# EAGLE schematic A13-OLinuXino (EAGLE 4.16)
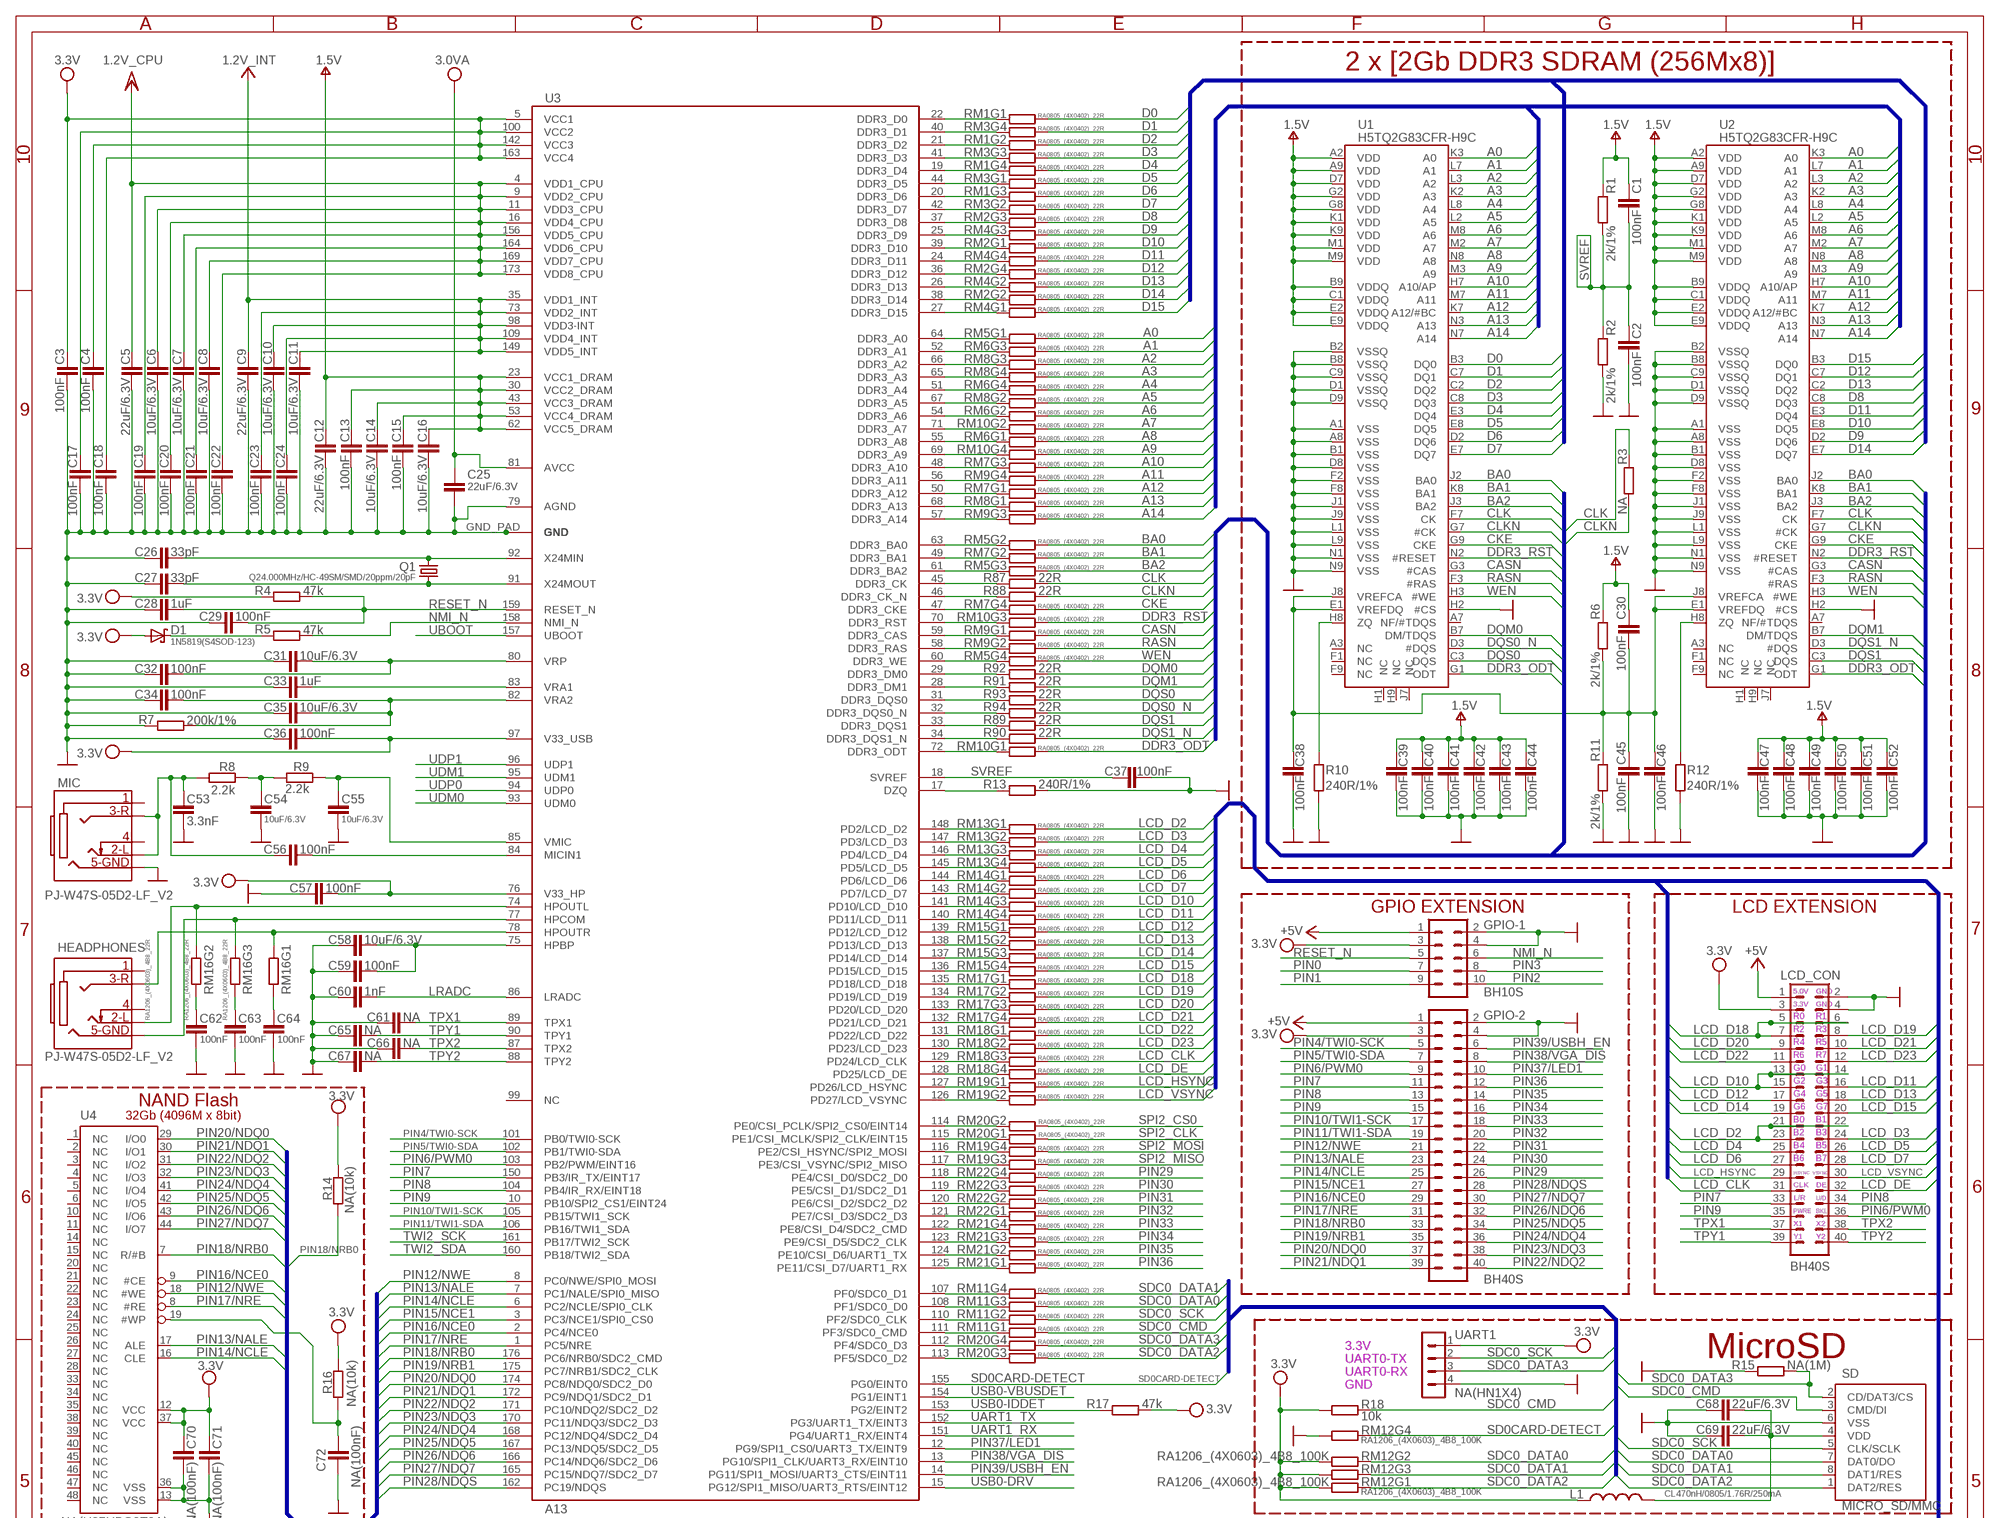
[diagram p0: schematic, sheet 1, part 1 of 2]
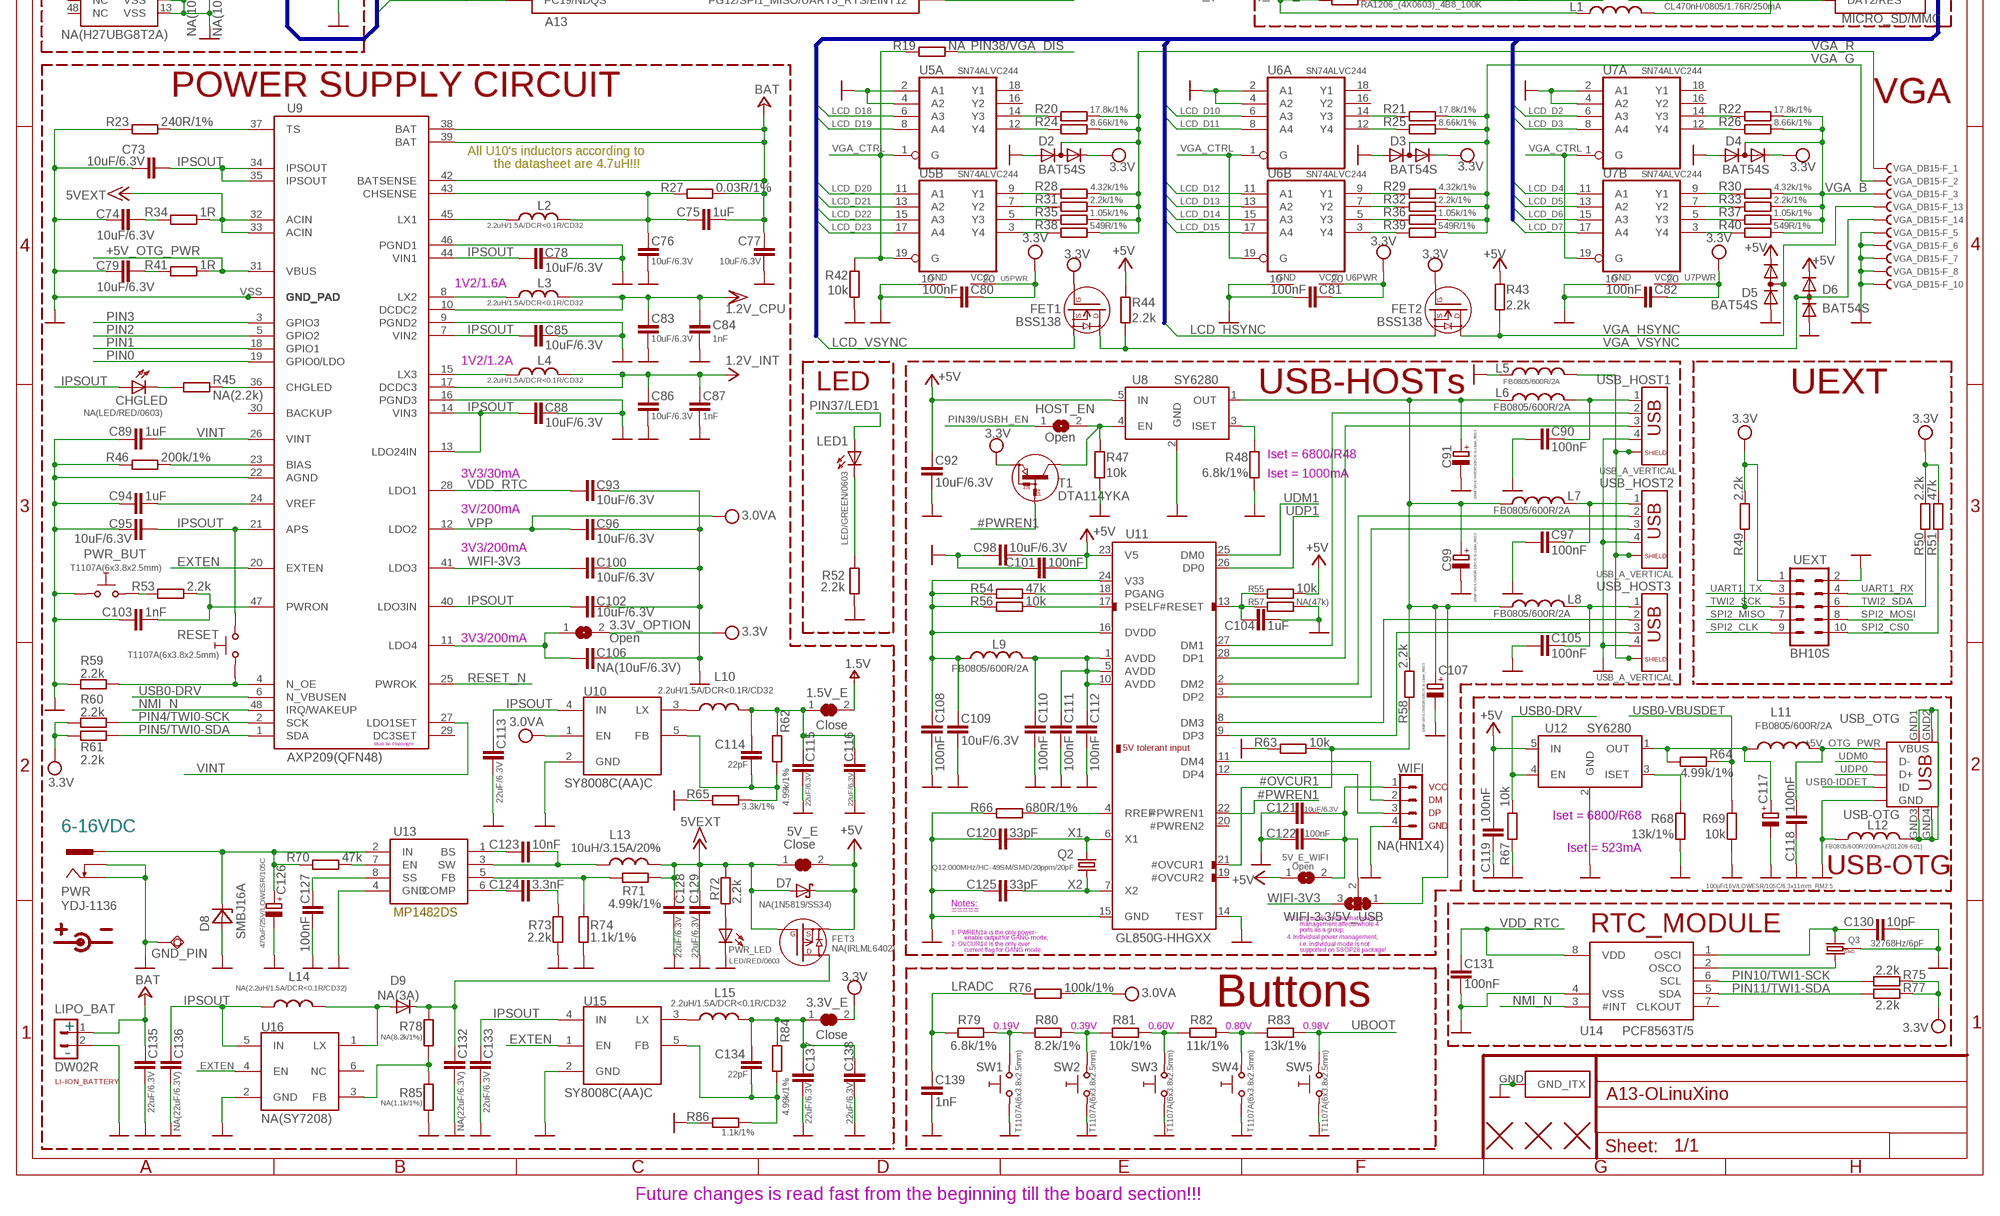
[diagram p1: schematic, sheet 1, part 2 of 2]

## Parts
1.5V_E  Close  SJSJ_1_SMALLER_CLOSE  [SJ_1_SMALLER_CLOSE]
3.3V_E  Close  SJSJ_1_SMALLER_CLOSE  [SJ_1_SMALLER_CLOSE]
3.3V_OPTION  Open  SJSJ_SMALLER  [SJ_1_SMALLER]
5V_E  Close  SJSJ_1_SMALLER_CLOSE  [SJ_1_SMALLER_CLOSE]
5V_E_WIFI  Open  SJSJ_SMALLER  [SJ_1_SMALLER]
C1  100nF  C-EUC0603_DWS  [C0603_DWS]
C2  100nF  C-EUC0603_DWS  [C0603_DWS]
C3  100nF  C-EUC0603_DWS  [C0603_DWS]
C4  100nF  C-EUC0603_DWS  [C0603_DWS]
C5  22uF/6.3V  C-EUC0603_DWS  [C0603_DWS]
C6  10uF/6.3V  C-EUC0603_DWS  [C0603_DWS]
C7  10uF/6.3V  C-EUC0603_DWS  [C0603_DWS]
C8  10uF/6.3V  C-EUC0603_DWS  [C0603_DWS]
C9  22uF/6.3V  C-EUC0603_DWS  [C0603_DWS]
C10  10uF/6.3V  C-EUC0603_DWS  [C0603_DWS]
C11  10uF/6.3V  C-EUC0603_DWS  [C0603_DWS]
C12  22uF/6.3V  C-EUC0603_DWS  [C0603_DWS]
C13  100nF  C-EUC0603_DWS  [C0603_DWS]
C14  10uF/6.3V  C-EUC0603_DWS  [C0603_DWS]
C15  100nF  C-EUC0603_DWS  [C0603_DWS]
C16  10uF/6.3V  C-EUC0603_DWS  [C0603_DWS]
C17  100nF  C-EUC0603_DWS  [C0603_DWS]
C18  100nF  C-EUC0603_DWS  [C0603_DWS]
C19  100nF  C-EUC0603_DWS  [C0603_DWS]
C20  100nF  C-EUC0603_DWS  [C0603_DWS]
C21  100nF  C-EUC0603_DWS  [C0603_DWS]
C22  100nF  C-EUC0603_DWS  [C0603_DWS]
C23  100nF  C-EUC0603_DWS  [C0603_DWS]
C24  100nF  C-EUC0603_DWS  [C0603_DWS]
C25  22uF/6.3V  C-EUC0603_DWS  [C0603_DWS]
C26  33pF  C-EUC0603_DWS  [C0603_DWS]
C27  33pF  C-EUC0603_DWS  [C0603_DWS]
C28  1uF  C-EUC0603_DWS  [C0603_DWS]
C29  100nF  C-EUC0603_DWS  [C0603_DWS]
C30  100nF  C-EUC0603_DWS  [C0603_DWS]
C31  10uF/6.3V  C-EUC0603_DWS  [C0603_DWS]
C32  100nF  C-EUC0603_DWS  [C0603_DWS]
C33  1uF  C-EUC0603_DWS  [C0603_DWS]
C34  100nF  C-EUC0603_DWS  [C0603_DWS]
C35  10uF/6.3V  C-EUC0603_DWS  [C0603_DWS]
C36  100nF  C-EUC0603_DWS  [C0603_DWS]
C37  100nF  C-EUC0603_DWS  [C0603_DWS]
C38  100nF  C-EUC0603_DWS  [C0603_DWS]
C39  100nF  C-EUC0603_DWS  [C0603_DWS]
C40  100nF  C-EUC0603_DWS  [C0603_DWS]
C41  100nF  C-EUC0603_DWS  [C0603_DWS]
C42  100nF  C-EUC0603_DWS  [C0603_DWS]
C43  100nF  C-EUC0603_DWS  [C0603_DWS]
C44  100nF  C-EUC0603_DWS  [C0603_DWS]
C45  100nF  C-EUC0603_DWS  [C0603_DWS]
C46  100nF  C-EUC0603_DWS  [C0603_DWS]
C47  100nF  C-EUC0603_DWS  [C0603_DWS]
C48  100nF  C-EUC0603_DWS  [C0603_DWS]
C49  100nF  C-EUC0603_DWS  [C0603_DWS]
C50  100nF  C-EUC0603_DWS  [C0603_DWS]
C51  100nF  C-EUC0603_DWS  [C0603_DWS]
C52  100nF  C-EUC0603_DWS  [C0603_DWS]
C53  3.3nF  C-EUC0603_DWS  [C0603_DWS]
C54  10uF/6.3V  C-EUC0603_DWS  [C0603_DWS]
C55  10uF/6.3V  C-EUC0603_DWS  [C0603_DWS]
C56  100nF  C-EUC0603_DWS  [C0603_DWS]
C57  100nF  C-EUC0603_DWS  [C0603_DWS]
C58  10uF/6.3V  C-EUC0603_DWS  [C0603_DWS]
C59  100nF  C-EUC0603_DWS  [C0603_DWS]
C60  1nF  C-EUC0603_DWS  [C0603_DWS]
C61  NA  C-EUC0603_DWS  [C0603_DWS]
C62  100nF  C-EUC0603_DWS  [C0603_DWS]
C63  100nF  C-EUC0603_DWS  [C0603_DWS]
C64  100nF  C-EUC0603_DWS  [C0603_DWS]
C65  NA  C-EUC0603_DWS  [C0603_DWS]
C66  NA  C-EUC0603_DWS  [C0603_DWS]
C67  NA  C-EUC0603_DWS  [C0603_DWS]
C68  22uF/6.3V  C-EUC0603_DWS  [C0603_DWS]
C69  22uF/6.3V  C-EUC0603_DWS  [C0603_DWS]
C70  NA(100nF)  C-EUC0603_DWS  [C0603_DWS]
C71  NA(100nF)  C-EUC0603_DWS  [C0603_DWS]
C72  NA(100nF)  C-EUC0603_DWS  [C0603_DWS]
C73  10uF/6.3V  C-EUC0603_DWS  [C0603_DWS]
C74  10uF/6.3V  C-EUC0603_DWS  [C0603_DWS]
C75  1uF  C-EUC0603_DWS  [C0603_DWS]
C76  10uF/6.3V  C-EUC0603_DWS  [C0603_DWS]
C77  10uF/6.3V  C-EUC0603_DWS  [C0603_DWS]
C78  10uF/6.3V  C-EUC0603_DWS  [C0603_DWS]
C79  10uF/6.3V  C-EUC0603_DWS  [C0603_DWS]
C80  100nF  C-EUC0603_DWS  [C0603_DWS]
C81  100nF  C-EUC0603_DWS  [C0603_DWS]
C82  100nF  C-EUC0603_DWS  [C0603_DWS]
C83  10uF/6.3V  C-EUC0603_DWS  [C0603_DWS]
C84  1nF  C-EUC0603_DWS  [C0603_DWS]
C85  10uF/6.3V  C-EUC0603_DWS  [C0603_DWS]
C86  10uF/6.3V  C-EUC0603_DWS  [C0603_DWS]
C87  1nF  C-EUC0603_DWS  [C0603_DWS]
C88  10uF/6.3V  C-EUC0603_DWS  [C0603_DWS]
C89  1uF  C-EUC0603_DWS  [C0603_DWS]
C90  100nF  C-EUC0603_DWS  [C0603_DWS]
C91  100uF/16V/LOWESR/105C/6.3x11mm_RM2.5  CPOL-EUE2.5-6.3  [E2,5-6,3]
C92  10uF/6.3V  C-EUC0603_DWS  [C0603_DWS]
C93  10uF/6.3V  C-EUC0603_DWS  [C0603_DWS]
C94  1uF  C-EUC0603_DWS  [C0603_DWS]
C95  10uF/6.3V  C-EUC0603_DWS  [C0603_DWS]
C96  10uF/6.3V  C-EUC0603_DWS  [C0603_DWS]
C97  100nF  C-EUC0603_DWS  [C0603_DWS]
C98  10uF/6.3V  C-EUC0603_DWS  [C0603_DWS]
C99  100uF/16V/LOWESR/105C/6.3x11mm_RM2.5  CPOL-EUE2.5-6.3  [E2,5-6,3]
C100  10uF/6.3V  C-EUC0603_DWS  [C0603_DWS]
C101  100nF  C-EUC0603_DWS  [C0603_DWS]
C102  10uF/6.3V  C-EUC0603_DWS  [C0603_DWS]
C103  1nF  C-EUC0603_DWS  [C0603_DWS]
C104  1uF  C-EUC0603_DWS  [C0603_DWS]
C105  100nF  C-EUC0603_DWS  [C0603_DWS]
C106  NA(10uF/6.3V)  C-EUC0603_DWS  [C0603_DWS]
C107  100uF/16V/LOWESR/105C/6.3x11mm_RM2.5  CPOL-EUE2.5-6.3  [E2,5-6,3]
C108  100nF  C-EUC0603_DWS  [C0603_DWS]
C109  10uF/6.3V  C-EUC0603_DWS  [C0603_DWS]
C110  100nF  C-EUC0603_DWS  [C0603_DWS]
C111  100nF  C-EUC0603_DWS  [C0603_DWS]
C112  100nF  C-EUC0603_DWS  [C0603_DWS]
C113  22uF/6.3V  C-EUC0603_DWS  [C0603_DWS]
C114  22pF  C-EUC0603_DWS  [C0603_DWS]
C115  22uF/6.3V  C-EUC0603_DWS  [C0603_DWS]
C116  22uF/6.3V  C-EUC0603_DWS  [C0603_DWS]
C117  100uF/16V/LOWESR/105C/6.3x11mm_RM2.5  CPOL-EUE2.5-6.3  [E2,5-6,3]
C118  100nF  C-EUC0603_DWS  [C0603_DWS]
C119  100nF  C-EUC0603_DWS  [C0603_DWS]
C120  33pF  C-EUC0603_DWS  [C0603_DWS]
C121  10uF/6.3V  C-EUC0603_DWS  [C0603_DWS]
C122  100nF  C-EUC0603_DWS  [C0603_DWS]
C123  10nF  C-EUC0603_DWS  [C0603_DWS]
C124  3.3nF  C-EUC0603_DWS  [C0603_DWS]
C125  33pF  C-EUC0603_DWS  [C0603_DWS]
C126  470uF/25V/LOWESR/105C  CPOL-EUE5-10.5  [E5-10,5]
C127  100nF  C-EUC0603_DWS  [C0603_DWS]
C128  22uF/6.3V  C-EUC0603_DWS  [C0603_DWS]
C129  22uF/6.3V  C-EUC0603_DWS  [C0603_DWS]
C130  10pF  C-EUC0603_DWS  [C0603_DWS]
C131  100nF  C-EUC0603_DWS  [C0603_DWS]
C132  NA(22uF/6.3V)  C-EUC0603_DWS  [C0603_DWS]
C133  22uF/6.3V  C-EUC0603_DWS  [C0603_DWS]
C134  22pF  C-EUC0603_DWS  [C0603_DWS]
C135  22uF/6.3V  C-EUC0603_DWS  [C0603_DWS]
C136  NA(22uF/6.3V)  C-EUC0603_DWS  [C0603_DWS]
C137  22uF/6.3V  C-EUC0603_DWS  [C0603_DWS]
C138  22uF/6.3V  C-EUC0603_DWS  [C0603_DWS]
C139  1nF  C-EUC0603_DWS  [C0603_DWS]
CHGLED  NA(LED/RED/0603)  LED0603DWS  [LED-0603]
D1  1N5819(S4SOD-123)  SCHOTKKY7.62SS-1N5819(S4SOD-123)  [SOD-123]
D2  BAT54S  DIODE_AC-AC_  [SOT23C(BAT54S)]
D3  BAT54S  DIODE_AC-AC_  [SOT23C(BAT54S)]
D4  BAT54S  DIODE_AC-AC_  [SOT23C(BAT54S)]
D5  BAT54S  DIODE_AC-AC_  [SOT23C(BAT54S)]
D6  BAT54S  DIODE_AC-AC_  [SOT23C(BAT54S)]
D7  NA(1N5819/SS34)  SCHOTKKY7.62SS2  [MLL-41]
D8  SMBJ16A  [DO214AA]
D9  NA(3A)  D-SMB  [SMB]
FET1  BSS138  N-MOS+DIODBSS138  [SOT23]
FET2  BSS138  N-MOS+DIODBSS138  [SOT23]
FET3  NA(IRLML6402)  P-MOS+DIODIRLML6402  [SOT23]
GND_PIN  TESTPAD3  [TEST_PAD40/70/SQUARE]
GPIO-1  BH10S  ML10  [ML10-MALE]
GPIO-2  BH40S  ML40  [ML40]
HEADPHONES  PJ-W47S-05D2-LF_V2  AUDIO_JACK_5PINPJ-W47S-05D2-LF_V2  [PJ-W47S-05D2-LF_5PIN_V2]
HOST_EN  Open  SJSJ_SMALLER  [SJ_1_SMALLER]
L1  CL470nH/0805/1.76R/250mA  L-USL0805_5MIL_DWS  [L0805_5MIL_DWS]
L2  2.2uH/1.5A/DCR<0.1R/CD32  L-CD32  [CD32]
L3  2.2uH/1.5A/DCR<0.1R/CD32  L-CD32  [CD32]
L4  2.2uH/1.5A/DCR<0.1R/CD32  L-CD32  [CD32]
L5  FB0805/600R/2A  L-USL0805_5MIL_DWS  [L0805_5MIL_DWS]
L6  FB0805/600R/2A  L-USL0805_5MIL_DWS  [L0805_5MIL_DWS]
L7  FB0805/600R/2A  L-USL0805_5MIL_DWS  [L0805_5MIL_DWS]
L8  FB0805/600R/2A  L-USL0805_5MIL_DWS  [L0805_5MIL_DWS]
L9  FB0805/600R/2A  L-USL0805_5MIL_DWS  [L0805_5MIL_DWS]
L10  2.2uH/1.5A/DCR<0.1R/CD32  L-CD32  [CD32]
L11  FB0805/600R/2A  L-USL0805_5MIL_DWS  [L0805_5MIL_DWS]
L12  FB0805/600R/200mA(201209-601)  L-USL0805_5MIL_DWS  [L0805_5MIL_DWS]
L13  10uH/3.15A/20%  LLQH88PN100M38  [8X8MM_3131]
L14  NA(2.2uH/1.5A/DCR<0.1R/CD32)  L-CD32  [CD32]
L15  2.2uH/1.5A/DCR<0.1R/CD32  L-CD32  [CD32]
LCD_CON  BH40S  ML40  [ML40]
LED1  LED/GREEN/0603  LED0603DWS  [LED-0603]
LIPO_BAT  DW02R  CON2DW02R  [DW02R]
MIC  PJ-W47S-05D2-LF_V2  AUDIO_JACK_5PINPJ-W47S-05D2-LF_V2  [PJ-W47S-05D2-LF_5PIN_V2]
PWR  YDJ-1136  PWR-JAKPWR_JACK_UNI_MILLING  [PWR_JACK_UNI_MILLING]
PWR_BUT  T1107A(6x3.8x2.5mm)  SW-TAKT6  [SW-TAKT_6X3.5_SMD]
PWR_LED  LED/RED/0603  LED0603DWS  [LED-0603]
Q1  Q24.000MHz/HC-49SM/SMD/20ppm/20pF  HC49/S1  [HC49/SMD2_THIN]
Q2  Q12.000MHz/HC-49SM/SMD/20ppm/20pF  HC49/S1  [HC49/SMD2_THIN]
Q3  32768Hz/6pF  Q_GND1  [TC26H_3_REPAIR_SMD]
R1  2k/1%  R-EU_R0603_5MIL_DWS  [R0603_5MIL_DWS]
R2  2k/1%  R-EU_R0603_5MIL_DWS  [R0603_5MIL_DWS]
R3  NA  R-EU_R0603_5MIL_DWS  [R0603_5MIL_DWS]
R4  47k  R-EU_R0603_5MIL_DWS  [R0603_5MIL_DWS]
R5  47k  R-EU_R0603_5MIL_DWS  [R0603_5MIL_DWS]
R6  2k/1%  R-EU_R0603_5MIL_DWS  [R0603_5MIL_DWS]
R7  200k/1%  R-EU_R0603_5MIL_DWS  [R0603_5MIL_DWS]
R8  2.2k  R-EU_R0603_5MIL_DWS  [R0603_5MIL_DWS]
R9  2.2k  R-EU_R0603_5MIL_DWS  [R0603_5MIL_DWS]
R10  240R/1%  R-EU_R0603_5MIL_DWS  [R0603_5MIL_DWS]
R11  2k/1%  R-EU_R0603_5MIL_DWS  [R0603_5MIL_DWS]
R12  240R/1%  R-EU_R0603_5MIL_DWS  [R0603_5MIL_DWS]
R13  240R/1%  R-EU_R0603_5MIL_DWS  [R0603_5MIL_DWS]
R14  NA(10k)  R-EU_R0603_5MIL_DWS  [R0603_5MIL_DWS]
R15  NA(1M)  R-EU_R0603_5MIL_DWS  [R0603_5MIL_DWS]
R16  NA(10k)  R-EU_R0603_5MIL_DWS  [R0603_5MIL_DWS]
R17  47k  R-EU_R0603_5MIL_DWS  [R0603_5MIL_DWS]
R18  10k  R-EU_R0603_5MIL_DWS  [R0603_5MIL_DWS]
R19  NA  R-EU_R0603_5MIL_DWS  [R0603_5MIL_DWS]
R20  17.8k/1%  R-EU_R0603_5MIL_DWS  [R0603_5MIL_DWS]
R21  17.8k/1%  R-EU_R0603_5MIL_DWS  [R0603_5MIL_DWS]
R22  17.8k/1%  R-EU_R0603_5MIL_DWS  [R0603_5MIL_DWS]
R23  240R/1%  R-EU_R0603_5MIL_DWS  [R0603_5MIL_DWS]
R24  8.66k/1%  R-EU_R0603_5MIL_DWS  [R0603_5MIL_DWS]
R25  8.66k/1%  R-EU_R0603_5MIL_DWS  [R0603_5MIL_DWS]
R26  8.66k/1%  R-EU_R0603_5MIL_DWS  [R0603_5MIL_DWS]
R27  0.03R/1%  R-EU_R1206_5MIL_WS  [R1206_5MIL_WS]
R28  4.32k/1%  R-EU_R0603_5MIL_DWS  [R0603_5MIL_DWS]
R29  4.32k/1%  R-EU_R0603_5MIL_DWS  [R0603_5MIL_DWS]
R30  4.32k/1%  R-EU_R0603_5MIL_DWS  [R0603_5MIL_DWS]
R31  2.2k/1%  R-EU_R0603_5MIL_DWS  [R0603_5MIL_DWS]
R32  2.2k/1%  R-EU_R0603_5MIL_DWS  [R0603_5MIL_DWS]
R33  2.2k/1%  R-EU_R0603_5MIL_DWS  [R0603_5MIL_DWS]
R34  1R  R-EU_R0603_5MIL_DWS  [R0603_5MIL_DWS]
R35  1.05k/1%  R-EU_R0603_5MIL_DWS  [R0603_5MIL_DWS]
R36  1.05k/1%  R-EU_R0603_5MIL_DWS  [R0603_5MIL_DWS]
R37  1.05k/1%  R-EU_R0603_5MIL_DWS  [R0603_5MIL_DWS]
R38  549R/1%  R-EU_R0603_5MIL_DWS  [R0603_5MIL_DWS]
R39  549R/1%  R-EU_R0603_5MIL_DWS  [R0603_5MIL_DWS]
R40  549R/1%  R-EU_R0603_5MIL_DWS  [R0603_5MIL_DWS]
R41  1R  R-EU_R0603_5MIL_DWS  [R0603_5MIL_DWS]
R42  10k  R-EU_R0603_5MIL_DWS  [R0603_5MIL_DWS]
R43  2.2k  R-EU_R0603_5MIL_DWS  [R0603_5MIL_DWS]
R44  2.2k  R-EU_R0603_5MIL_DWS  [R0603_5MIL_DWS]
R45  NA(2.2k)  R-EU_R0603_5MIL_DWS  [R0603_5MIL_DWS]
R46  200k/1%  R-EU_R0603_5MIL_DWS  [R0603_5MIL_DWS]
R47  10k  R-EU_R0603_5MIL_DWS  [R0603_5MIL_DWS]
R48  6.8k/1%  R-EU_R0603_5MIL_DWS  [R0603_5MIL_DWS]
R49  2.2k  R-EU_R0603_5MIL_DWS  [R0603_5MIL_DWS]
R50  2.2k  R-EU_R0603_5MIL_DWS  [R0603_5MIL_DWS]
R51  47k  R-EU_R0603_5MIL_DWS  [R0603_5MIL_DWS]
R52  2.2k  R-EU_R0603_5MIL_DWS  [R0603_5MIL_DWS]
R53  2.2k  R-EU_R0603_5MIL_DWS  [R0603_5MIL_DWS]
R54  47k  R-EU_R0603_5MIL_DWS  [R0603_5MIL_DWS]
R55  10k  R-EU_R0603_5MIL_DWS  [R0603_5MIL_DWS]
R56  10k  R-EU_R0603_5MIL_DWS  [R0603_5MIL_DWS]
R57  NA(47k)  R-EU_R0603_5MIL_DWS  [R0603_5MIL_DWS]
R58  2.2k  R-EU_R0603_5MIL_DWS  [R0603_5MIL_DWS]
R59  2.2k  R-EU_R0603_5MIL_DWS  [R0603_5MIL_DWS]
R60  2.2k  R-EU_R0603_5MIL_DWS  [R0603_5MIL_DWS]
R61  2.2k  R-EU_R0603_5MIL_DWS  [R0603_5MIL_DWS]
R62  4.99k/1%  R-EU_R0603_5MIL_DWS  [R0603_5MIL_DWS]
R63  10k  R-EU_R0603_5MIL_DWS  [R0603_5MIL_DWS]
R64  4.99k/1%  R-EU_R0603_5MIL_DWS  [R0603_5MIL_DWS]
R65  3.3k/1%  R-EU_R0603_5MIL_DWS  [R0603_5MIL_DWS]
R66  680R/1%  R-EU_R0603_5MIL_DWS  [R0603_5MIL_DWS]
R67  10k  R-EU_R0603_5MIL_DWS  [R0603_5MIL_DWS]
R68  13k/1%  R-EU_R0603_5MIL_DWS  [R0603_5MIL_DWS]
R69  10k  R-EU_R0603_5MIL_DWS  [R0603_5MIL_DWS]
R70  47k  R-EU_R0603_5MIL_DWS  [R0603_5MIL_DWS]
R71  4.99k/1%  R-EU_R0603_5MIL_DWS  [R0603_5MIL_DWS]
R72  2.2k  R-EU_R0603_5MIL_DWS  [R0603_5MIL_DWS]
R73  2.2k  R-EU_R0603_5MIL_DWS  [R0603_5MIL_DWS]
R74  1.1k/1%  R-EU_R0603_5MIL_DWS  [R0603_5MIL_DWS]
R75  2.2k  R-EU_R0603_5MIL_DWS  [R0603_5MIL_DWS]
R76  100k/1%  R-EU_R0603_5MIL_DWS  [R0603_5MIL_DWS]
R77  2.2k  R-EU_R0603_5MIL_DWS  [R0603_5MIL_DWS]
R78  NA(8.2k/1%)  R-EU_R0603_5MIL_DWS  [R0603_5MIL_DWS]
R79  6.8k/1%  R-EU_R0603_5MIL_DWS  [R0603_5MIL_DWS]
R80  8.2k/1%  R-EU_R0603_5MIL_DWS  [R0603_5MIL_DWS]
R81  10k/1%  R-EU_R0603_5MIL_DWS  [R0603_5MIL_DWS]
R82  11k/1%  R-EU_R0603_5MIL_DWS  [R0603_5MIL_DWS]
R83  13k/1%  R-EU_R0603_5MIL_DWS  [R0603_5MIL_DWS]
R84  4.99k/1%  R-EU_R0603_5MIL_DWS  [R0603_5MIL_DWS]
R85  NA(1.1k/1%)  R-EU_R0603_5MIL_DWS  [R0603_5MIL_DWS]
R86  1.1k/1%  R-EU_R0603_5MIL_DWS  [R0603_5MIL_DWS]
R87  22R  R-EU_R0603_5MIL_DWS  [R0603_5MIL_DWS]
R88  22R  R-EU_R0603_5MIL_DWS  [R0603_5MIL_DWS]
R89  22R  R-EU_R0603_5MIL_DWS  [R0603_5MIL_DWS]
R90  22R  R-EU_R0603_5MIL_DWS  [R0603_5MIL_DWS]
R91  22R  R-EU_R0603_5MIL_DWS  [R0603_5MIL_DWS]
R92  22R  R-EU_R0603_5MIL_DWS  [R0603_5MIL_DWS]
R93  22R  R-EU_R0603_5MIL_DWS  [R0603_5MIL_DWS]
R94  22R  R-EU_R0603_5MIL_DWS  [R0603_5MIL_DWS]
RESET  T1107A(6x3.8x2.5mm)  SW-TAKT6  [SW-TAKT_6X3.5_SMD]
RM1  RA0805_(4X0402)_22R  R_MATRIX_4ER_MATRIX_4_0402  [R_MATRIX_4_0402]
RM2  RA0805_(4X0402)_22R  R_MATRIX_4ER_MATRIX_4_0402  [R_MATRIX_4_0402]
RM3  RA0805_(4X0402)_22R  R_MATRIX_4ER_MATRIX_4_0402  [R_MATRIX_4_0402]
RM4  RA0805_(4X0402)_22R  R_MATRIX_4ER_MATRIX_4_0402  [R_MATRIX_4_0402]
RM5  RA0805_(4X0402)_22R  R_MATRIX_4ER_MATRIX_4_0402  [R_MATRIX_4_0402]
RM6  RA0805_(4X0402)_22R  R_MATRIX_4ER_MATRIX_4_0402  [R_MATRIX_4_0402]
RM7  RA0805_(4X0402)_22R  R_MATRIX_4ER_MATRIX_4_0402  [R_MATRIX_4_0402]
RM8  RA0805_(4X0402)_22R  R_MATRIX_4ER_MATRIX_4_0402  [R_MATRIX_4_0402]
RM9  RA0805_(4X0402)_22R  R_MATRIX_4ER_MATRIX_4_0402  [R_MATRIX_4_0402]
RM10  RA0805_(4X0402)_22R  R_MATRIX_4ER_MATRIX_4_0402  [R_MATRIX_4_0402]
RM11  RA0805_(4X0402)_22R  R_MATRIX_4ER_MATRIX_4_0402  [R_MATRIX_4_0402]
RM12  RA1206_(4X0603)_4B8_100K  R_MATRIX_4E  [R_MATRIX_4]
RM13  RA0805_(4X0402)_22R  R_MATRIX_4ER_MATRIX_4_0402  [R_MATRIX_4_0402]
RM14  RA0805_(4X0402)_22R  R_MATRIX_4ER_MATRIX_4_0402  [R_MATRIX_4_0402]
RM15  RA0805_(4X0402)_22R  R_MATRIX_4ER_MATRIX_4_0402  [R_MATRIX_4_0402]
RM16  RA1206_(4X0603)_4B8_22R  R_MATRIX_4ER_MATRIX_4_0402  [R_MATRIX_4_0402]
RM17  RA0805_(4X0402)_22R  R_MATRIX_4ER_MATRIX_4_0402  [R_MATRIX_4_0402]
RM18  RA0805_(4X0402)_22R  R_MATRIX_4ER_MATRIX_4_0402  [R_MATRIX_4_0402]
RM19  RA0805_(4X0402)_22R  R_MATRIX_4ER_MATRIX_4_0402  [R_MATRIX_4_0402]
RM20  RA0805_(4X0402)_22R  R_MATRIX_4ER_MATRIX_4_0402  [R_MATRIX_4_0402]
RM21  RA0805_(4X0402)_22R  R_MATRIX_4ER_MATRIX_4_0402  [R_MATRIX_4_0402]
RM22  RA0805_(4X0402)_22R  R_MATRIX_4ER_MATRIX_4_0402  [R_MATRIX_4_0402]
SD  MICRO_SD/MMC  MICRO_SD/MMC_NEW  [TFR/C-MEM-CON]
SW1  T1107A(6x3.8x2.5mm)  SW-TAKT6  [SW-TAKT_6X3.5_SMD]
SW2  T1107A(6x3.8x2.5mm)  SW-TAKT6  [SW-TAKT_6X3.5_SMD]
SW3  T1107A(6x3.8x2.5mm)  SW-TAKT6  [SW-TAKT_6X3.5_SMD]
SW4  T1107A(6x3.8x2.5mm)  SW-TAKT6  [SW-TAKT_6X3.5_SMD]
SW5  T1107A(6x3.8x2.5mm)  SW-TAKT6  [SW-TAKT_6X3.5_SMD]
T1  DTA114YKA  DIGITAL_TRANSISTORS-PNPDTA114YKA  [SOT-23]
U1  H5TQ2G83CFR-H9C  [FBGA78]
U2  H5TQ2G83CFR-H9C  [FBGA78]
U3  A13  [TQFP176]
U4  NA(H27UBG8T2A)  H27UBG8T2A  [TSOP48]
U5  SN74ALVC244  74ALVC244  [PW]
U6  SN74ALVC244  74ALVC244  [PW]
U7  SN74ALVC244  74ALVC244  [PW]
U8  SY6280  [SOT23-5]
U9  AXP209(QFN48)  AXP209  [QFN48]
U10  SY8008C(AA)C  SY8008  [SOT23-5]
U11  GL850G-HHGXX  GL850G  [SSOP28]
U12  SY6280  [SOT23-5]
U13  MP1482DS  MP1482  [SOIC8]
U14  PCF8563T/5  PCF8563  [SO-8]
U15  SY8008C(AA)C  SY8008  [SOT23-5]
U16  NA(SY7208)  SY7208  [SOT23-6]
U$1  FIDUCIAL1X2  [FIDUCIAL-1X2]
U$2  FIDUCIAL1X2  [FIDUCIAL-1X2]
U$3  FIDUCIAL1X2  [FIDUCIAL-1X2]
U$4  NANO_ITX  [NANO-ITX_120X120]
UART1  NA(HN1X4)  CON4HN1X4  [HN1X4]
UEXT  BH10S  ML10  [ML10-MALE]
USB_HOST1  USB_A_VERTICAL  USB_SHIELDUSB_A_VERTICAL  [USB_A_VERTICAL_PTH]
USB_HOST2  USB_A_VERTICAL  USB_SHIELDUSB_A_VERTICAL  [USB_A_VERTICAL_PTH]
USB_HOST3  USB_A_VERTICAL  USB_SHIELDUSB_A_VERTICAL  [USB_A_VERTICAL_PTH]
USB_OTG  USB-OTG  MINI_USB9  [USB_MINI_9PIN]
VGA_DB15-F  VGA15  DB1522  [DB15-F_22MM]
WIFI  NA(HN1X4)  CON4HN1X4  [HN1X4]
WIFI-3.3/5V_USB  SJ2W6  [SJ_2_SMALL_12_TIED]

## Nets
#OVCUR1: R58.1 R63.2 U11.21(#OVCUR1)
#PWREN1: T1.1(B) U11.22(#PWREN1)
+5V: 5V_E.2 5V_E_WIFI.1 C92.1 C98.1 C101.1 C119.1 D5.2(K) D6.2(K) D7.K(C) FET3.2(S) GPIO-1.1 GPIO-2.1 LCD_CON.1 R43.2 R44.2 R55.2 U8.5(IN) U11.23(V5) U12.5(IN)
+5V_OTG_PWR: C118.1 L11.1 R41.2 U9.31(VBUS) USB_OTG.VBUS
+15V: 5V_E.1 C128.1 C129.1 D7.A FET3.1(G) L13.2 R34.2 R71.2 R72.1 U9.32(ACIN) U9.33(ACIN) ; supply symbol labelled 5VEXT
+24V: C75.2 C77.1 C135.2 LIPO_BAT.1 R27.2 U9.38(BAT) U9.39(BAT) U9.42(BATSENSE) ; supply symbol labelled BAT
A0: RM5.1.2 U1.K3(A0) U2.K3(A0)
A1: RM6.3.2 U1.L7(A1) U2.L7(A1)
A2: RM8.3.2 U1.L3(A2) U2.L3(A2)
A3: RM8.4.2 U1.K2(A3) U2.K2(A3)
A4: RM6.4.2 U1.L8(A4) U2.L8(A4)
A5: RM8.2.2 U1.L2(A5) U2.L2(A5)
A6: RM6.2.2 U1.M8(A6) U2.M8(A6)
A7: RM10.2.2 U1.M2(A7) U2.M2(A7)
A8: RM6.1.2 U1.N8(A8) U2.N8(A8)
A9: RM10.4.2 U1.M3(A9) U2.M3(A9)
A10: RM7.3.2 U1.H7(A10/AP) U2.H7(A10/AP)
A11: RM9.4.2 U1.M7(A11) U2.M7(A11)
A12: RM7.1.2 U1.K7(A12/#BC) U2.K7(A12/#BC)
A13: RM8.1.2 U1.N3(A13) U2.N3(A13)
A14: RM9.3.2 U1.N7(A14) U2.N7(A14)
AVDD: C110.1 C111.1 C112.1 L9.2 U11.1(AVDD) U11.5(AVDD) U11.10(AVDD)
BA0: RM5.2.2 U1.J2(BA0) U2.J2(BA0)
BA1: RM7.2.2 U1.K8(BA1) U2.K8(BA1)
BA2: RM5.3.2 U1.J3(BA2) U2.J3(BA2)
CASN: RM9.1.2 U1.G3(#CAS) U2.G3(#CAS)
CKE: RM7.4.2 U1.G9(CKE) U2.G9(CKE)
CLK: R3.2 R87.1 U1.F7(CK) U2.F7(CK)
CLKN: R3.1 R88.1 U1.G7(#CK) U2.G7(#CK)
D0: RM1.1.2 U1.B3(DQ0)
D1: RM3.4.2 U1.C7(DQ1)
D2: RM1.2.2 U1.C2(DQ2)
D3: RM3.3.2 U1.C8(DQ3)
D4: RM1.4.2 U1.E3(DQ4)
D5: RM3.1.2 U1.E8(DQ5)
D6: RM1.3.2 U1.D2(DQ6)
D7: RM3.2.2 U1.E7(DQ7)
D8: RM2.3.2 U2.C8(DQ3)
D9: RM4.3.2 U2.D2(DQ6)
D10: RM2.1.2 U2.E8(DQ5)
D11: RM4.4.2 U2.E3(DQ4)
D12: RM2.4.2 U2.C7(DQ1)
D13: RM4.2.2 U2.C2(DQ2)
D14: RM2.2.2 U2.E7(DQ7)
D15: RM4.1.2 U2.B3(DQ0)
DDR3_A0: RM5.1.1 U3.64(DDR3_A0)
DDR3_A1: RM6.3.1 U3.52(DDR3_A1)
DDR3_A2: RM8.3.1 U3.66(DDR3_A2)
DDR3_A3: RM8.4.1 U3.65(DDR3_A3)
DDR3_A4: RM6.4.1 U3.51(DDR3_A4)
DDR3_A5: RM8.2.1 U3.67(DDR3_A5)
DDR3_A6: RM6.2.1 U3.54(DDR3_A6)
DDR3_A7: RM10.2.1 U3.71(DDR3_A7)
DDR3_A8: RM6.1.1 U3.55(DDR3_A8)
DDR3_A9: RM10.4.1 U3.69(DDR3_A9)
DDR3_A10: RM7.3.1 U3.48(DDR3_A10)
DDR3_A11: RM9.4.1 U3.56(DDR3_A11)
DDR3_A12: RM7.1.1 U3.50(DDR3_A12)
DDR3_A13: RM8.1.1 U3.68(DDR3_A13)
DDR3_A14: RM9.3.1 U3.57(DDR3_A14)
DDR3_BA0: RM5.2.1 U3.63(DDR3_BA0)
DDR3_BA1: RM7.2.1 U3.49(DDR3_BA1)
DDR3_BA2: RM5.3.1 U3.61(DDR3_BA2)
DDR3_CAS: RM9.1.1 U3.59(DDR3_CAS)
DDR3_CK: R87.2 U3.45(DDR3_CK)
DDR3_CK_N: R88.2 U3.46(DDR3_CK_N)
DDR3_CKE: RM7.4.1 U3.47(DDR3_CKE)
DDR3_D0: RM1.1.1 U3.22(DDR3_D0)
DDR3_D1: RM3.4.1 U3.40(DDR3_D1)
DDR3_D2: RM1.2.1 U3.21(DDR3_D2)
DDR3_D3: RM3.3.1 U3.41(DDR3_D3)
DDR3_D4: RM1.4.1 U3.19(DDR3_D4)
DDR3_D5: RM3.1.1 U3.44(DDR3_D5)
DDR3_D6: RM1.3.1 U3.20(DDR3_D6)
DDR3_D7: RM3.2.1 U3.42(DDR3_D7)
DDR3_D8: RM2.3.1 U3.37(DDR3_D8)
DDR3_D9: RM4.3.1 U3.25(DDR3_D9)
DDR3_D10: RM2.1.1 U3.39(DDR3_D10)
DDR3_D11: RM4.4.1 U3.24(DDR3_D11)
DDR3_D12: RM2.4.1 U3.36(DDR3_D12)
DDR3_D13: RM4.2.1 U3.26(DDR3_D13)
DDR3_D14: RM2.2.1 U3.38(DDR3_D14)
DDR3_D15: RM4.1.1 U3.27(DDR3_D15)
DDR3_DM0: R92.2 U3.29(DDR3_DM0)
DDR3_DM1: R91.2 U3.28(DDR3_DM1)
DDR3_DQS0: R93.2 U3.31(DDR3_DQS0)
DDR3_DQS0_N: R94.2 U3.32(DDR3_DQS0_N)
DDR3_DQS1: R89.2 U3.33(DDR3_DQS1)
DDR3_DQS1_N: R90.2 U3.34(DDR3_DQS1_N)
DDR3_ODT: RM10.1.2 U1.G1(ODT) U2.G1(ODT)
DDR3_ODTT: RM10.1.1 U3.72(DDR3_ODT)
DDR3_RAS: RM9.2.1 U3.58(DDR3_RAS)
DDR3_RST: RM10.3.2 U1.N2(#RESET) U2.N2(#RESET)
DDR3_RSTT: RM10.3.1 U3.70(DDR3_RST)
DDR3_WE: RM5.4.1 U3.60(DDR3_WE)
DM1: U11.27(DM1) USB_HOST1.2
DM2: U11.2(DM2) USB_HOST2.2
DM3: U11.8(DM3) USB_HOST3.2
DM4: U11.11(DM4) WIFI.2
DP1: U11.28(DP1) USB_HOST1.3
DP2: U11.3(DP2) USB_HOST2.3
DP3: U11.9(DP3) USB_HOST3.3
DP4: U11.12(DP4) WIFI.3
DQM0: R92.1 U1.B7(DM/TDQS)
DQM1: R91.1 U2.B7(DM/TDQS)
DQS0: R93.1 U1.C3(DQS)
DQS0_N: R94.1 U1.D3(#DQS)
DQS1: R89.1 U2.C3(DQS)
DQS1_N: R90.1 U2.D3(#DQS)
DVDD: C108.1 C109.1 L9.1 R54.1 R56.1 U11.16(DVDD) U11.24(V33)
DZQ: R13.2 U3.17(DZQ)
EXTEN: U9.20(EXTEN) U15.1(EN) U16.4(EN)
GND [pwr]: C2.1 C3.1 C4.1 C5.1 C6.1 C7.1 C8.1 C9.1 C10.1 C11.1 C12.1 C13.1 C14.1 C15.1 C16.1 C17.1 C18.1 C19.1 C20.1 C21.1 C22.1 C23.1 C24.1 C25.1 C26.1 C27.1 C28.1 C29.1 C31.1 C32.1 C33.1 C34.1 C35.1 C36.1 C37.1 C38.1 C39.1 C40.1 C41.1 C42.1 C43.1 C44.1 C45.1 C46.1 C47.1 C48.1 C49.1 C50.1 C51.1 C52.1 C53.1 C54.1 C55.1 C57.1 C58.1 C59.1 C60.1 C61.1 C62.1 C63.1 C64.1 C65.1 C66.1 C67.1 C68.1 C69.1 C70.1 C71.1 C72.1 C73.1 C74.1 C76.2 C77.2 C78.2 C79.1 C80.2 C81.2 C82.2 C83.2 C84.2 C85.2 C86.2 C87.2 C88.2 C89.1 C90.2 C91.- C92.2 C93.2 C94.1 C95.1 C96.2 C97.2 C98.2 C99.- C100.2 C101.2 C102.2 C103.1 C104.1 C105.2 C106.2 C107.- C108.2 C109.2 C110.2 C111.2 C112.2 C113.2 C115.2 C116.2 C117.- C118.2 C119.2 C120.1 C121.2 C122.2 C125.1 C126.- C127.2 C128.2 C129.2 C130.2 C131.1 C132.2 C133.2 C135.1 C136.1 C137.2 C138.2 C139.2 D2.1(A) D3.1(A) D4.1(A) D5.1(A) D6.1(A) D8.A GND_PIN.P$1(PP) GPIO-1.2 GPIO-1.4 GPIO-2.2 GPIO-2.4 L5.1 L12.1 LCD_CON.2 LCD_CON.4 LIPO_BAT.2 MIC.5 PWR.- PWR.-- PWR_BUT.P$1 PWR_LED.C Q3.GND R2.1 R7.2 R10.1 R11.1 R12.1 R13.1 R15.2 R23.1 R42.1 R46.1 R47.1 R48.1 R52.1 R57.2 R59.1 R63.1 R65.2 R66.1 R67.1 R68.1 R69.1 R73.2 R74.2 R85.2 R86.2 RM12.4.1 SD.6(VSS) SW1.P$1 SW2.P$1 SW3.P$1 SW4.P$1 SW5.P$1 U1.A1(VSS) U1.A8(VSS) U1.B1(VSS) U1.B2(VSSQ) U1.B8(VSSQ) U1.C9(VSSQ) U1.D1(VSSQ) U1.D8(VSS) U1.D9(VSSQ) U1.F2(VSS) U1.F8(VSS) U1.H2(#CS) U1.J1(VSS) U1.J9(VSS) U1.L1(VSS) U1.L9(VSS) U1.N1(VSS) U1.N9(VSS) U2.A1(VSS) U2.A8(VSS) U2.B1(VSS) U2.B2(VSSQ) U2.B8(VSSQ) U2.C9(VSSQ) U2.D1(VSSQ) U2.D8(VSS) U2.D9(VSSQ) U2.F2(VSS) U2.F8(VSS) U2.H2(#CS) U2.J1(VSS) U2.J9(VSS) U2.L1(VSS) U2.L9(VSS) U2.N1(VSS) U2.N9(VSS) U3.79(AGND) U3.GND_PAD(GND) U3.P$2(GND) U3.P$3(GND) U3.P$4(GND) U3.P$5(GND) U3.P$6(GND) U3.P$7(GND) U3.P$8(GND) U3.P$9(GND) U3.P$10(GND) U3.P$11(GND) U3.P$12(GND) U3.P$13(GND) U3.P$14(GND) U3.P$15(GND) U3.P$16(GND) U3.P$17(GND) U3.P$18(GND) U4.13(VSS) U4.36(VSS) U5.2(A:A1) U5.4(A:A2) U5.10(PWR:GND) U6.2(A:A1) U6.4(A:A2) U6.10(PWR:GND) U7.2(A:A1) U7.4(A:A2) U7.10(PWR:GND) U8.2(GND) U9.9(PGND2) U9.16(PGND3) U9.22(AGND) U9.46(PGND1) U9.N1(GND_PAD) U9.N2(GND_PAD) U9.N3(GND_PAD) U9.N4(GND_PAD) U9.N5(GND_PAD) U9.N6(GND_PAD) U9.N7(GND_PAD) U9.N8(GND_PAD) U9.N9(GND_PAD) U9.N10(GND_PAD) U9.N11(GND_PAD) U9.N12(GND_PAD) U9.N13(GND_PAD) U9.N14(GND_PAD) U9.N15(GND_PAD) U9.N16(GND_PAD) U9.N17(GND_PAD) U9.VSS(GND_PAD) U10.2(GND) U11.14(TEST) U11.15(GND) U12.2(GND) U13.4(GND) U14.4(VSS) U15.2(GND) U16.2(GND) U$4.GND(GND_ITX) U$4.P$2(GND_ITX) U$4.P$3(GND_ITX) U$4.P$4(GND_ITX) UART1.4 UEXT.2 USB_HOST1.4 USB_HOST2.4 USB_HOST3.4 USB_OTG.GND VGA_DB15-F.5 VGA_DB15-F.6 VGA_DB15-F.7 VGA_DB15-F.8 VGA_DB15-F.10 WIFI.4
IPSOUT: C73.2 C78.1 C85.1 C88.1 C95.2 C102.1 C113.1 C133.1 C136.2 CHGLED.A L14.1 RESET.P$2 U9.7(VIN2) U9.13(LDO24IN) U9.14(VIN3) U9.21(APS) U9.34(IPSOUT) U9.35(IPSOUT) U9.40(LDO3IN) U9.44(VIN1) U10.4(IN) U15.4(IN) U16.5(IN)
LCD_CLK: LCD_CON.31 RM18.3.2
LCD_D2: LCD_CON.21 LCD_CON.22 LCD_CON.23 RM13.1.2 U7.6(A:A3)
LCD_D3: LCD_CON.24 RM13.2.2 U7.8(A:A4)
LCD_D4: LCD_CON.25 RM13.3.2 U7.11(B:A1)
LCD_D5: LCD_CON.26 RM13.4.2 U7.13(B:A2)
LCD_D6: LCD_CON.27 RM14.1.2 U7.15(B:A3)
LCD_D7: LCD_CON.28 RM14.2.2 U7.17(B:A4)
LCD_D10: LCD_CON.13 LCD_CON.14 LCD_CON.15 RM14.3.2 U6.6(A:A3)
LCD_D11: LCD_CON.16 RM14.4.2 U6.8(A:A4)
LCD_D12: LCD_CON.17 RM15.1.2 U6.11(B:A1)
LCD_D13: LCD_CON.18 RM15.2.2 U6.13(B:A2)
LCD_D14: LCD_CON.19 RM15.3.2 U6.15(B:A3)
LCD_D15: LCD_CON.20 RM15.4.2 U6.17(B:A4)
LCD_D18: LCD_CON.5 LCD_CON.6 LCD_CON.7 RM17.1.2 U5.6(A:A3)
LCD_D19: LCD_CON.8 RM17.2.2 U5.8(A:A4)
LCD_D20: LCD_CON.9 RM17.3.2 U5.11(B:A1)
LCD_D21: LCD_CON.10 RM17.4.2 U5.13(B:A2)
LCD_D22: LCD_CON.11 RM18.1.2 U5.15(B:A3)
LCD_D23: LCD_CON.12 RM18.2.2 U5.17(B:A4)
LCD_DE: LCD_CON.32 RM18.4.2
LCD_HSYNC: FET2.2(S) LCD_CON.29 RM19.1.2
LCD_VSYNC: FET1.2(S) LCD_CON.30 RM19.2.2
LRADC: C60.2 C139.1 R76.2 R79.1 U3.86(LRADC)
N$1: C58.2 C59.2 U3.75(HPBP)
N$2: C30.2 C38.2 C45.2 C46.2 R6.1 R11.2 U1.E1(VREFDQ) U1.J8(VREFCA) U2.E1(VREFDQ) U2.J8(VREFCA)
N$3: R10.2 U1.H8(ZQ)
N$4: R45.2 U9.36(CHGLED)
N$5: R12.2 U2.H8(ZQ)
N$8: L10.1 U10.3(LX)
N$9: C31.2 C32.2 U3.80(VRP)
N$10: D1.C R5.2
N$11 [pwr]: 5V_E_WIFI.2 C121.1 C122.1 WIFI-3.3/5V_USB.2 WIFI.1
N$13: C33.2 U3.83(VRA1)
N$14: C34.2 C35.2 R7.1 U3.82(VRA2)
N$16: C53.2 C56.1 MIC.2 MIC.3 R8.2
N$18: 1.5V_E.1 C114.1 C115.1 C116.1 L10.2 R62.1
N$19: C114.2 R62.2 R65.1 U10.5(FB)
N$20: R37.1 U7.5(B:Y3)
N$22: C54.2 R8.1 R9.2
N$23: C132.1 D9.1(C) FET3.3(D) R78.2
N$25: C56.2 U3.84(MICIN1)
N$26: HEADPHONES.2 RM16.2.2 U3.74(HPOUTL)
N$27: HEADPHONES.5 RM16.3.2 U3.77(HPCOM)
N$28: HEADPHONES.3 RM16.1.2 U3.78(HPOUTR)
N$31: C126.+ D8.C PWR.+ R70.1 U13.2(IN)
N$34: C62.2 RM16.2.1
N$35: C63.2 RM16.3.1
N$36: C127.1 U13.8(SS)
N$37: R70.2 U13.7(EN)
N$38: PWR_BUT.P$2 R53.1
N$42: LED1.C R52.2
N$43: CHGLED.C R45.1
N$44: C64.2 RM16.1.1
N$46: C123.1 U13.1(BS)
N$50: C123.2 L13.1 U13.3(SW)
N$60: C124.1 U13.6(COMP)
N$61: C124.2 R73.1
N$62: R71.1 R74.1 U13.5(FB)
N$64: L15.1 U15.3(LX)
N$65: 3.3V_E.1 C134.1 C137.1 C138.1 L15.2 R84.1
N$66: C134.2 R84.2 R86.1 U15.5(FB)
N$87: RM11.1.1 U3.111(PF3/SDC0_CMD)
N$88: R79.2 R80.1 SW1.P$2
N$89: R80.2 R81.1 SW2.P$2
N$90: R81.2 R82.1 SW3.P$2
N$91: R82.2 R83.1 SW4.P$2
N$92: RM11.2.1 U3.110(PF2/SDC0_CLK)
N$93: RM11.3.1 U3.108(PF1/SDC0_D0)
N$94: RM11.4.1 U3.107(PF0/SDC0_D1)
N$95: RM20.4.1 U3.112(PF4/SDC0_D3)
N$96: RM20.3.1 U3.113(PF5/SDC0_D2)
N$97: RM20.1.1 U3.115(PE1/CSI_MCLK/SPI2_CLK/EINT15)
N$98: RM20.2.1 U3.114(PE0/CSI_PCLK/SPI2_CS0/EINT14)
N$99: R68.2 U12.3(ISET)
N$100: C117.+ L11.2 R64.2 U12.1(OUT)
N$101: R48.2 U8.3(ISET)
N$102: R66.2 U11.4(RREF)
N$103: R40.1 U7.3(B:Y4)
N$104: R30.1 U7.9(B:Y1)
N$105: R54.2 U11.18(PGANG)
N$106: R56.2 U11.17(PSELF)
N$107: R33.1 U7.7(B:Y2)
N$108: R22.1 U7.14(A:Y3)
N$109: R26.1 U7.12(A:Y4)
N$110: L5.2 USB_HOST1.P$3 USB_HOST1.P$4 USB_HOST2.P$3 USB_HOST2.P$4 USB_HOST3.P$3 USB_HOST3.P$4
N$111: C90.1 L6.2 USB_HOST1.1
N$112: C97.1 L7.2 USB_HOST2.1
N$113: C105.1 L8.2 USB_HOST3.1
N$114: C91.+ C99.+ C107.+ L6.1 L7.1 L8.1 R58.2 U8.1(OUT) WIFI-3.3/5V_USB.1
N$117: R29.1 U6.9(B:Y1)
N$118: R32.1 U6.7(B:Y2)
N$119: C104.2 R55.1 R57.1 U11.13(#RESET)
N$120: R46.2 U9.23(BIAS)
N$121: C130.1 Q3.2 U14.1(OSCI)
N$122: Q3.1 U14.2(OSCO)
N$123: D9.2(A) L14.2 U16.1(LX)
N$124: C72.2 R16.2 U4.19(#WP)
N$125: R23.2 U9.37(TS)
N$126: R78.1 R85.1 U16.3(FB)
N$127: L2.1 U9.45(LX1)
N$128: C75.1 C76.1 L2.2 R27.1 U9.43(CHSENSE)
N$129: PWR_LED.A R72.2
N$130: L3.1 U9.8(LX2)
N$131: L4.1 U9.15(LX3)
N$132: C94.2 U9.24(VREF)
N$133 [pwr]: 3.3V_OPTION.1 C106.1 U9.11(LDO4)
N$134: C74.2 R34.1
N$135: C79.2 R41.1
N$136: RM13.1.1 U3.148(PD2/LCD_D2)
N$137 [pwr]: HOST_EN.2 R47.2 T1.3(C) U8.4(EN)
N$138: R36.1 U6.5(B:Y3)
N$139: C103.2 R53.2 U9.47(PWRON)
N$140: R59.2 RESET.P$1 U9.4(N_OE)
N$141: RM13.2.1 U3.147(PD3/LCD_D3)
N$142: RM13.3.1 U3.146(PD4/LCD_D4)
N$143: RM13.4.1 U3.145(PD5/LCD_D5)
N$144: RM14.1.1 U3.144(PD6/LCD_D6)
N$145: RM14.2.1 U3.143(PD7/LCD_D7)
N$146: RM14.3.1 U3.141(PD10/LCD_D10)
N$147: RM14.4.1 U3.140(PD11/LCD_D11)
N$148: RM15.1.1 U3.139(PD12/LCD_D12)
N$149: RM15.2.1 U3.138(PD13/LCD_D13)
N$150: RM15.3.1 U3.137(PD14/LCD_D14)
N$151: RM15.4.1 U3.136(PD15/LCD_D15)
N$152: RM17.1.1 U3.135(PD18/LCD_D18)
N$153: RM17.2.1 U3.134(PD19/LCD_D19)
N$154: RM17.3.1 U3.133(PD20/LCD_D20)
N$155: RM17.4.1 U3.132(PD21/LCD_D21)
N$156: RM18.1.1 U3.131(PD22/LCD_D22)
N$157: RM18.2.1 U3.130(PD23/LCD_D23)
N$158: RM18.3.1 U3.129(PD24/LCD_CLK)
N$159: RM18.4.1 U3.128(PD25/LCD_DE)
N$160: RM19.1.1 U3.127(PD26/LCD_HSYNC)
N$161: RM19.2.1 U3.126(PD27/LCD_VSYNC)
N$162: RM21.1.1 U3.125(PE11/CSI_D7/UART1_RX)
N$163: RM21.2.1 U3.124(PE10/CSI_D6/UART1_TX)
N$164: RM22.3.1 U3.119(PE5/CSI_D1/SDC2_D1)
N$165: RM22.4.1 U3.118(PE4/CSI_D0/SDC2_D0)
N$166: RM19.4.1 U3.116(PE2/CSI_HSYNC/SPI2_MOSI)
N$167: RM19.3.1 U3.117(PE3/CSI_VSYNC/SPI2_MISO)
N$168: RM21.3.1 U3.123(PE9/CSI_D5/SDC2_CLK)
N$169: RM21.4.1 U3.122(PE8/CSI_D4/SDC2_CMD)
N$170: RM22.1.1 U3.121(PE7/CSI_D3/SDC2_D3)
N$171: RM22.2.1 U3.120(PE6/CSI_D2/SDC2_D2)
N$172: R39.1 U6.3(B:Y4)
N$173: R21.1 U6.14(A:Y3)
N$174: R25.1 U6.12(A:Y4)
N$177: R28.1 U5.9(B:Y1)
N$178: R31.1 U5.7(B:Y2)
N$179: R35.1 U5.5(B:Y3)
N$180: R38.1 U5.3(B:Y4)
N$181: R20.1 U5.14(A:Y3)
N$182: R24.1 U5.12(A:Y4)
N$266: L12.2 USB_OTG.GND1 USB_OTG.GND2 USB_OTG.GND3 USB_OTG.GND4
NMI_N: GPIO-1.6 R5.1 U3.158(NMI_N) U9.48(IRQ/WAKEUP) U14.3(#INT)
PIN0: GPIO-1.7 U9.19(GPIO0/LDO)
PIN1: GPIO-1.9 U9.18(GPIO1)
PIN2: GPIO-1.10 U9.5(GPIO2)
PIN3: GPIO-1.8 U9.3(GPIO3)
PIN4/TWI0-SCK: GPIO-2.5 R60.1 U3.101(PB0/TWI0-SCK) U9.2(SCK)
PIN5/TWI0-SDA: GPIO-2.7 R61.1 U3.102(PB1/TWI0-SDA) U9.1(SDA)
PIN6/PWM0: GPIO-2.9 LCD_CON.36 U3.103(PB2/PWM/EINT16)
PIN7: GPIO-2.11 LCD_CON.33 U3.150(PB3/IR_TX/EINT17)
PIN8: GPIO-2.13 LCD_CON.34 U3.104(PB4/IR_RX/EINT18)
PIN9: GPIO-2.15 LCD_CON.35 U3.10(PB10/SPI2_CS1/EINT24)
PIN10/TWI1-SCK: GPIO-2.17 R75.1 U3.105(PB15/TWI1_SCK) U14.6(SCL)
PIN11/TWI1-SDA: GPIO-2.19 R77.1 U3.106(PB16/TWI1_SDA) U14.5(SDA)
PIN12/NWE: GPIO-2.21 U3.8(PC0/NWE/SPI0_MOSI) U4.18(#WE)
PIN13/NALE: GPIO-2.23 U3.7(PC1/NALE/SPI0_MISO) U4.17(ALE)
PIN14/NCLE: GPIO-2.25 U3.6(PC2/NCLE/SPI0_CLK) U4.16(CLE)
PIN15/NCE1: GPIO-2.27 U3.3(PC3/NCE1/SPI0_CS0)
PIN16/NCE0: GPIO-2.29 U3.2(PC4/NCE0) U4.9(#CE)
PIN17/NRE: GPIO-2.31 U3.1(PC5/NRE) U4.8(#RE)
PIN18/NRB0: GPIO-2.33 R14.2 U3.176(PC6/NRB0/SDC2_CMD) U4.7(R/#B)
PIN19/NRB1: GPIO-2.35 U3.175(PC7/NRB1/SDC2_CLK)
PIN20/NDQ0: GPIO-2.37 U3.174(PC8/NDQ0/SDC2_D0) U4.29(I/O0)
PIN21/NDQ1: GPIO-2.39 U3.172(PC9/NDQ1/SDC2_D1) U4.30(I/O1)
PIN22/NDQ2: GPIO-2.40 U3.171(PC10/NDQ2/SDC2_D2) U4.31(I/O2)
PIN23/NDQ3: GPIO-2.38 U3.170(PC11/NDQ3/SDC2_D3) U4.32(I/O3)
PIN24/NDQ4: GPIO-2.36 U3.168(PC12/NDQ4/SDC2_D4) U4.41(I/O4)
PIN25/NDQ5: GPIO-2.34 U3.167(PC13/NDQ5/SDC2_D5) U4.42(I/O5)
PIN26/NDQ6: GPIO-2.32 U3.166(PC14/NDQ6/SDC2_D6) U4.43(I/O6)
PIN27/NDQ7: GPIO-2.30 U3.165(PC15/NDQ7/SDC2_D7) U4.44(I/O7)
PIN28/NDQS: GPIO-2.28 U3.162(PC19/NDQS)
PIN29: GPIO-2.26 RM22.4.2
PIN30: GPIO-2.24 RM22.3.2
PIN31: GPIO-2.22 RM22.2.2
PIN32: GPIO-2.20 RM22.1.2
PIN33: GPIO-2.18 RM21.4.2
PIN34: GPIO-2.16 RM21.3.2
PIN35: GPIO-2.14 RM21.2.2
PIN36: GPIO-2.12 RM21.1.2
PIN37/LED1 [pwr]: GPIO-2.10 LED1.A U3.12(PG9/SPI1_CS0/UART3_TX/EINT9)
PIN38/VGA_DIS: GPIO-2.8 R19.2 U3.13(PG10/SPI1_CLK/UART3_RX/EINT10)
PIN39/USBH_EN [pwr]: GPIO-2.6 HOST_EN.1 U3.14(PG11/SPI1_MOSI/UART3_CTS/EINT11)
RASN: RM9.2.2 U1.F3(#RAS) U2.F3(#RAS)
RESET_N: C28.2 C29.2 GPIO-1.5 R4.1 U3.159(RESET_N) U9.25(PWROK)
SD0CARD-DETECT: RM12.4.2 U3.155(PG0/EINT0)
SD_VCC: C68.2 C69.2 L1.2 SD.4(VDD)
SDC0_CMD: R18.1 RM11.1.2 SD.3(CMD/DI)
SDC0_DATA0: RM11.3.2 RM12.2.1 SD.7(DAT0/DO)
SDC0_DATA1: RM11.4.2 RM12.3.1 SD.8(DAT1/RES)
SDC0_DATA2: RM12.1.1 RM20.3.2 SD.1(DAT2/RES)
SDC0_DATA3: R15.1 RM20.4.2 SD.2(CD/DAT3/CS) UART1.3
SDC0_SCK: RM11.2.2 SD.5(CLK/SCLK) UART1.2
SPI2_CLK: RM20.1.2 UEXT.9
SPI2_CS0: R51.1 RM20.2.2 UEXT.10
SPI2_MISO: RM19.3.2 UEXT.7
SPI2_MOSI: RM19.4.2 UEXT.8
SVREF: C1.2 C2.2 C37.2 R1.1 R2.2 U3.18(SVREF)
TPX1: C61.2 LCD_CON.37 U3.89(TPX1)
TPX2: C66.2 LCD_CON.38 U3.87(TPX2)
TPY1: C65.2 LCD_CON.39 U3.90(TPY1)
TPY2: C67.2 LCD_CON.40 U3.88(TPY2)
TWI2_SCK: R49.1 U3.161(PB17/TWI2_SCK) UEXT.5
TWI2_SDA: R50.1 U3.160(PB18/TWI2_SDA) UEXT.6
UART1_RX: U3.151(PG4/UART1_RX/EINT4) UEXT.4
UART1_TX: U3.152(PG3/UART1_TX/EINT3) UEXT.3
UBOOT: R83.2 SW5.P$2 U3.157(UBOOT)
UDM0: U3.93(UDM0) USB_OTG.D-
UDM1: U3.95(UDM1) U11.25(DM0)
UDP0: U3.94(UDP0) USB_OTG.D+
UDP1: U3.96(UDP1) U11.26(DP0)
USB0-DRV: R67.2 U3.15(PG12/SPI1_MISO/UART3_RTS/EINT12) U9.6(N_VBUSEN) U12.4(EN)
USB0-IDDET: R17.2 U3.153(PG2/EINT2) USB_OTG.ID
USB0-VBUSDET: R64.1 R69.2 U3.154(PG1/EINT1)
V+: 1.5V_E.2 C1.1 C12.2 C13.2 C14.2 C15.2 C16.2 C30.1 C39.2 C40.2 C41.2 C42.2 C43.2 C44.2 C47.2 C48.2 C49.2 C50.2 C51.2 C52.2 R1.2 R6.2 U1.A2(VDD) U1.A9(VDD) U1.B9(VDDQ) U1.C1(VDDQ) U1.D7(VDD) U1.E2(VDDQ) U1.E9(VDDQ) U1.G2(VDD) U1.G8(VDD) U1.K1(VDD) U1.K9(VDD) U1.M1(VDD) U1.M9(VDD) U2.A2(VDD) U2.A9(VDD) U2.B9(VDDQ) U2.C1(VDDQ) U2.D7(VDD) U2.E2(VDDQ) U2.E9(VDDQ) U2.G2(VDD) U2.G8(VDD) U2.K1(VDD) U2.K9(VDD) U2.M1(VDD) U2.M9(VDD) U3.23(VCC1_DRAM) U3.30(VCC2_DRAM) U3.43(VCC3_DRAM) U3.53(VCC4_DRAM) U3.62(VCC5_DRAM) ; supply symbol labelled 1.5V
VCC [pwr]: 3.3V_E.2 3.3V_OPTION.2 C3.2 C4.2 C17.2 C18.2 C36.2 C57.2 C70.2 C71.2 C80.1 C81.1 C82.1 D1.A D2.2(K) D3.2(K) D4.2(K) FET1.1(G) FET2.1(G) GPIO-1.3 GPIO-2.3 L1.1 LCD_CON.3 R4.2 R14.1 R16.1 R17.1 R18.2 R49.2 R50.2 R51.2 R60.2 R61.2 R75.2 R77.2 RM12.1.2 RM12.2.2 RM12.3.2 T1.2(E) U3.5(VCC1) U3.76(V33_HP) U3.97(V33_USB) U3.100(VCC2) U3.142(VCC3) U3.163(VCC4) U4.12(VCC) U4.37(VCC) U5.20(PWR:VCC) U6.20(PWR:VCC) U7.20(PWR:VCC) UART1.1 UEXT.1 ; supply symbol labelled 3.3V
VCC/2: C5.2 C6.2 C7.2 C8.2 C19.2 C20.2 C21.2 C22.2 C83.1 C84.1 L3.2 U3.4(VDD1_CPU) U3.9(VDD2_CPU) U3.11(VDD3_CPU) U3.16(VDD4_CPU) U3.156(VDD5_CPU) U3.164(VDD6_CPU) U3.169(VDD7_CPU) U3.173(VDD8_CPU) U9.10(DCDC2) ; supply symbol labelled 1.2V_CPU
VCCINT: C9.2 C10.2 C11.2 C23.2 C24.2 C86.1 C87.1 L4.2 U3.35(VDD1_INT) U3.73(VDD2_INT) U3.98(VDD3-INT) U3.109(VDD4_INT) U3.149(VDD5_INT) U9.17(DCDC3) ; supply symbol labelled 1.2V_INT
VDD_RTC: C93.1 C131.2 U9.28(LDO1) U14.8(VDD)
VGA_B: D4.3(AK) R22.2 R26.2 R30.2 R33.2 R37.2 R40.2 VGA_DB15-F.3
VGA_CTRL [pwr]: R19.1 R42.2 U5.1(A:G) U5.19(B:G) U6.1(A:G) U6.19(B:G) U7.1(A:G) U7.19(B:G)
VGA_G: D3.3(AK) R21.2 R25.2 R29.2 R32.2 R36.2 R39.2 VGA_DB15-F.2
VGA_HSYNC: D5.3(AK) FET2.3(D) R43.1 VGA_DB15-F.13
VGA_R: D2.3(AK) R20.2 R24.2 R28.2 R31.2 R35.2 R38.2 VGA_DB15-F.1
VGA_VSYNC: D6.3(AK) FET1.3(D) R44.1 VGA_DB15-F.14
VINT: C89.2 U9.26(VINT) U9.27(LDO1SET)
VMIC: C55.2 R9.1 U3.85(VMIC)
VPP [pwr]: C25.2 C96.1 R76.1 U3.81(AVCC) U9.12(LDO2) U10.1(EN) ; supply symbol labelled 3.0VA
WEN: RM5.4.2 U1.H3(#WE) U2.H3(#WE)
WIFI-3V3 [pwr]: C100.1 U9.41(LDO3) WIFI-3.3/5V_USB.3
X1: C120.2 Q2.2 U11.6(X1)
X2: C125.2 Q2.1 U11.7(X2)
XTALI: C26.2 Q1.2 U3.92(X24MIN)
XTALO: C27.2 Q1.1 U3.91(X24MOUT)
Unconnected: HEADPHONES.1 HEADPHONES.4 MIC.1 MIC.4 RM16.4.1 RM16.4.2 U1.A3(NC) U1.A7(NF/#TDQS) U1.F1(NC) U1.F9(NC) U1.H1(NC) U1.H9(NC) U1.J7(NC) U2.A3(NC) U2.A7(NF/#TDQS) U2.F1(NC) U2.F9(NC) U2.H1(NC) U2.H9(NC) U2.J7(NC) U3.99(NC) U4.1(NC) U4.2(NC) U4.3(NC) U4.4(NC) U4.5(NC) U4.6(NC) U4.10(NC) U4.11(NC) U4.14(NC) U4.15(NC) U4.20(NC) U4.21(NC) U4.22(NC) U4.23(NC) U4.24(NC) U4.25(NC) U4.26(NC) U4.27(NC) U4.28(NC) U4.33(NC) U4.34(NC) U4.35(NC) U4.38(NC) U4.39(NC) U4.40(NC) U4.45(NC) U4.46(NC) U4.47(NC) U4.48(NC) U5.16(A:Y2) U5.18(A:Y1) U6.16(A:Y2) U6.18(A:Y1) U7.16(A:Y2) U7.18(A:Y1) U9.29(DC3SET) U9.30(BACKUP) U11.19(#OVCUR2) U11.20(#PWREN2) U14.7(CLKOUT) U16.6(NC) VGA_DB15-F.4 VGA_DB15-F.9 VGA_DB15-F.11 VGA_DB15-F.12 VGA_DB15-F.15

## Buses
A[0..14]
D[0..15]
SDC0_SCK,SDC0_CMD,SDC0_DATA[0..3],SD0CARD-DETECT
BA[0..2],CLK,CLKN,CKE,CS,CASN,RASN,WEN,DQM[0..1],DQS[0..1],DQS0_N,DQS1_N,DDR3_RST,DDR3_ODT
LCD_D[2..7],LCD_D[10..15],LCD_D[18..23],LCD_HSYNC,LCD_VSYNC,LCD_CLK,LCD_DE
NDQ[0..7],NWE,NALE,NCLE,NCE0,NCE1,NRE,NRB[0..1],NDQS

## Notes on the sheet
- 2 x [2Gb DDR3 SDRAM (256Mx8)]
- GPIO EXTENSION | LCD EXTENSION
- 5.0V | GND
- 3.3V | GND
- R0 | R1
- R2 | R3
- R4 | R5
- R6 | R7
- G0 | G1
- G2 | G3
- G4 | G5
- NAND Flash
- G6 | G7
- 32Gb (4096M x 8bit)
- B0 | B1
- B2 | B3
- B4 | B5
- B6 | B7
- HSYNC | VSYNC
- CLK | DE
- L/R | U/D
- PWRE | BKL
- X1 | X2
- Y1 | Y2
- 3.3V
- MicroSD
- UART0-TX
- UART0-RX
- GND
- POWER SUPPLY CIRCUIT | VGA
- All U10's inductors according to
- the datasheet are 4.7uH!!!
- 1V2/1.6A
- 1V2/1.2A
- LED | USB-HOSTs | UEXT
- Iset = 6800/R48
- 3V3/30mA | Iset = 1000mA
- 3V/200mA
- 3V3/200mA
- 3V3/200mA
- Must be Floating!!!
- VCC
- DM
- DP
- Iset = 6800/R68
- GND
- 6-16VDC
- Iset = 523mA
- USB-OTG
- Notes:
- =====
- 3. Gang mode means that power
- management affects whole 4
- ports as a group; | RTC_MODULE
- 1. PWREN1# is the only power-
- enable output for GANG mode; | 4. Individual power management,
- 2. OVCUR1# is the only over | i.e. individual mode is not
- current flag for GANG mode; | supported on SSOP28 package!
- Buttons
- 0.19V | 0.39V | 0.60V | 0.80V | 0.98V
- +
- -
- LI-ION_BATTERY
- Future changes is read fast from the beginning till the board section!!!

## Power pins joined to a net without a drawn wire
GND: VGA_DB15-F.GND1 VGA_DB15-F.GND2

## Library data of the parts
1.5V_E 3.3V_E 3.3V_OPTION 5V_E 5V_E_WIFI HOST_EN = jumper:SJ: SMD solder JUMPER
C1-C90 C92-C98 C100-C106 C108-C116 C118-C125 C127-C139 = rcl:C-EU: CAPACITOR, European symbol
C91 C99 C107 C117 C126 = rcl:CPOL-EU: POLARIZED CAPACITOR, European symbol
CHGLED LED1 PWR_LED = DOUBLE-SIDE:LED
D1 D7 = gogo:SCHOTKKY7.62SS
D2-D6 = semicon-smd-ipc:DIODE_AC-AC_: DUAL DIODE
D8 = OLIMEX_DISCRET:SMBJ16A
D9 = semicon-smd-ipc:D-: DIODE unfilled
FET1 FET2 = Penko:N-MOS+DIOD
FET3 = Penko:P-MOS+DIOD
GND_PIN = gogo:TESTPAD: drill 40mils, diameter 70mils
GPIO-1 UEXT = con-harting-ml:ML10: HARTING
GPIO-2 LCD_CON = con-harting-ml:ML40: HARTING
HEADPHONES MIC = gogo:AUDIO_JACK_5PIN
L1 L5-L9 L11 L12 = rcl:L-US: INDUCTOR, American symbol
L2-L4 L10 L13-L15 = OLIMEX_DISCRET:L
LIPO_BAT = Penko:CON2
PWR = gogo:PWR-JAK
PWR_BUT RESET SW1-SW5 = gogo:SW-TAKT
Q1 Q2 = crystal:HC49/S: CRYSTAL
Q3 = crystal:Q_GND
R1-R94 = rcl:R-EU_: RESISTOR, European symbol
RM1-RM22 = OLIMEX_DISCRET:R_MATRIX_4E
SD = OLIMEX_CONNECTORS:MICRO_SD/MMC
T1 = OLIMEX_DISCRET:DIGITAL_TRANSISTORS-PNP: DTA114YKA Digital Transistor - PNP
U1 U2 = OLIMEX_IC:H5TQ2G83CFR-H9C
U3 = OLIMEX_IC:A13
U4 = OLIMEX_IC:H27UBG8T2A
U5-U7 = 74AC244:74ALVC244
U8 U12 = OLIMEX_IC:SY6280
U9 = OLIMEX_IC:AXP209
U10 U15 = OLIMEX_IC:SY8008
U11 = OLIMEX_IC:GL850G
U13 = OLIMEX_IC:MP1482
U14 = OLIMEX_IC:PCF8563: Real-time clock/calendar
U16 = OLIMEX_IC:SY7208
U$1-U$3 = SparkFunEagle-6-6-07:FIDUCIAL: Fiducial Alignment Points Various fiducial points for machine vision alignment.
U$4 = OLIMEX_CASES:NANO_ITX
UART1 WIFI = Penko:CON4
USB_HOST1-USB_HOST3 = OLIMEX_CONNECTORS:USB_SHIELD
USB_OTG = OLIMEX_CONNECTORS:MINI_USB9
VGA_DB15-F = OLIMEX_CONNECTORS:DB15
WIFI-3.3/5V_USB = jumper:SJ2W: SMD solder JUMPER

## Net classes
1 pwr: drill 0.127 mm